# EAGLE design MOD (EAGLE 9.2.2)
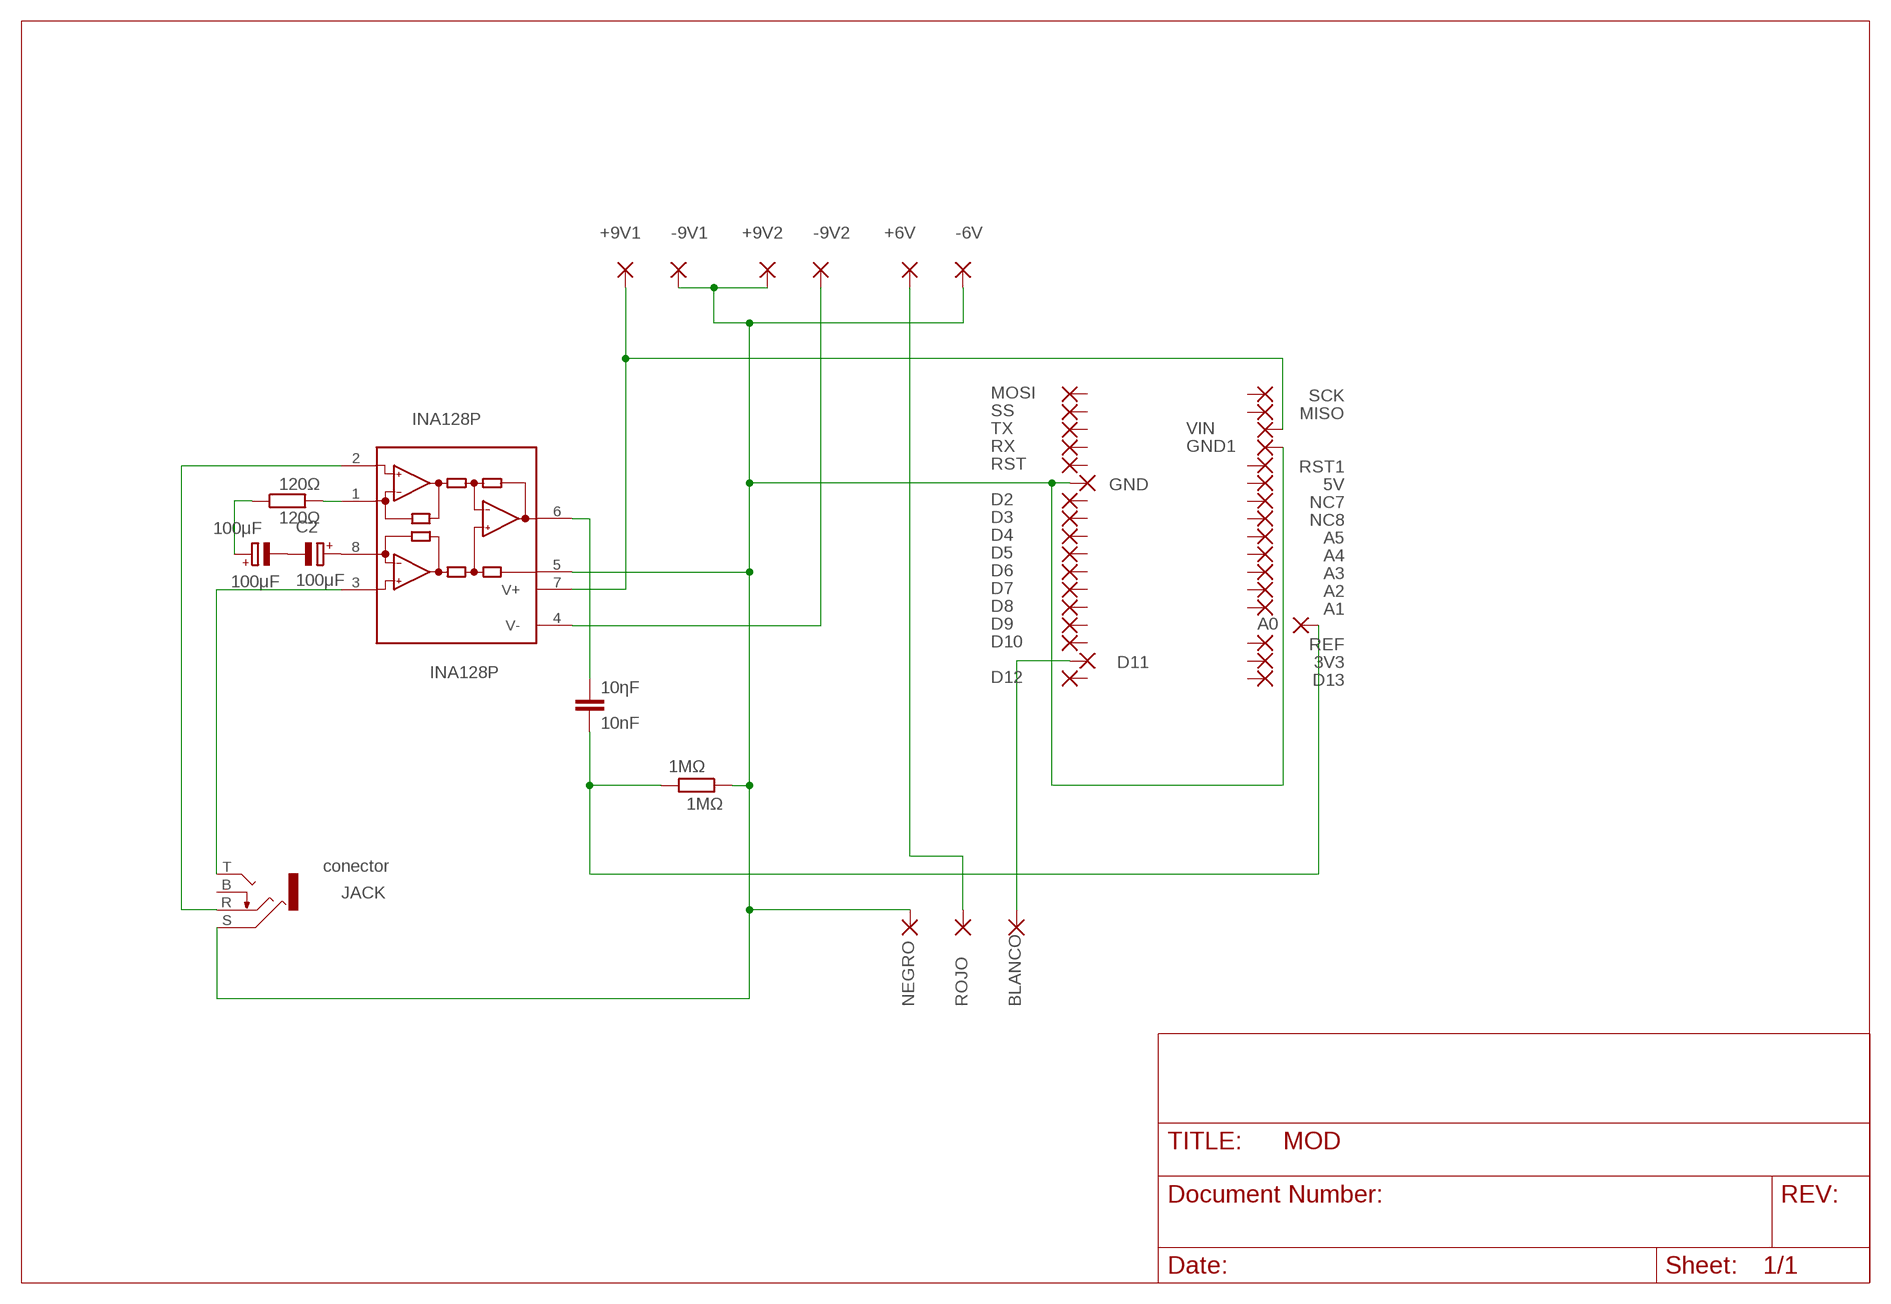
[diagram p0: schematic, sheet 1]

## Parts
1MΩ  1MΩ  R-EU_0207/15  [0207/15]
3V3  1,6/0,9  [1,6/0,9]
5V  1,6/0,9  [1,6/0,9]
10ηF  10nF  C-EU050-030X075  [C050-030X075]
100μF  100μF  CPOL-EUB45181B  [B45181B]
120Ω  120Ω  R-EU_0207/15  [0207/15]
+6V  2,54/1,1  [2,54/1,1]
+9V1  2,54/1,1  [2,54/1,1]
+9V2  2,54/1,1  [2,54/1,1]
-6V  2,54/1,1  [2,54/1,1]
-9V1  2,54/1,1  [2,54/1,1]
-9V2  2,54/1,1  [2,54/1,1]
A0  1,6/0,9  [1,6/0,9]
A1  1,6/0,9  [1,6/0,9]
A2  1,6/0,9  [1,6/0,9]
A3  1,6/0,9  [1,6/0,9]
A4  1,6/0,9  [1,6/0,9]
A5  1,6/0,9  [1,6/0,9]
BLANCO  1,6/0,9  [1,6/0,9]
C2  100μF  CPOL-EUB45181B  [B45181B]
D2  1,6/0,9  [1,6/0,9]
D3  1,6/0,9  [1,6/0,9]
D4  1,6/0,9  [1,6/0,9]
D5  1,6/0,9  [1,6/0,9]
D6  1,6/0,9  [1,6/0,9]
D7  1,6/0,9  [1,6/0,9]
D8  1,6/0,9  [1,6/0,9]
D9  1,6/0,9  [1,6/0,9]
D10  1,6/0,9  [1,6/0,9]
D11  1,6/0,9  [1,6/0,9]
D12  1,6/0,9  [1,6/0,9]
D13  1,6/0,9  [1,6/0,9]
GND  1,6/0,9  [1,6/0,9]
GND1  1,6/0,9  [1,6/0,9]
INA128P  INA128P  [DIL08]
JACK  conector  KLBR4  [KLBR4]
MISO  1,6/0,9  [1,6/0,9]
MOSI  1,6/0,9  [1,6/0,9]
NC7  1,6/0,9  [1,6/0,9]
NC8  1,6/0,9  [1,6/0,9]
NEGRO  1,6/0,9  [1,6/0,9]
REF  1,6/0,9  [1,6/0,9]
ROJO  1,6/0,9  [1,6/0,9]
RST  1,6/0,9  [1,6/0,9]
RST1  1,6/0,9  [1,6/0,9]
RX  1,6/0,9  [1,6/0,9]
SCK  1,6/0,9  [1,6/0,9]
SS  1,6/0,9  [1,6/0,9]
TX  1,6/0,9  [1,6/0,9]
VIN  1,6/0,9  [1,6/0,9]

## Nets
+6VCC: +6V.1(P) ROJO.1(P)
+9VCC: +9V1.1(P) INA128P.7(V+) VIN.1(P)
-9VCC: -9V2.1(P) INA128P.4(V-)
A0: 1MΩ.2 10ηF.2 A0.1(P)
CONTROL_SERVO: BLANCO.1(P) D11.1(P)
E1: INA128P.2(-IN) JACK.R
E2: INA128P.3(+IN) JACK.T
GND: 1MΩ.1 +9V2.1(P) -6V.1(P) -9V1.1(P) GND1.1(P) GND.1(P) INA128P.5(REF) JACK.S NEGRO.1(P)
N$1: C2.+ INA128P.8(RG)
N$2: 100μF.- C2.-
N$3: 120Ω.2 INA128P.1(RG)
N$4: 100μF.+ 120Ω.1
N$5: 10ηF.1 INA128P.6(OUT)
Unconnected: 3V3.1(P) 5V.1(P) A1.1(P) A2.1(P) A3.1(P) A4.1(P) A5.1(P) D2.1(P) D3.1(P) D4.1(P) D5.1(P) D6.1(P) D7.1(P) D8.1(P) D9.1(P) D10.1(P) D12.1(P) D13.1(P) JACK.B MISO.1(P) MOSI.1(P) NC7.1(P) NC8.1(P) REF.1(P) RST1.1(P) RST.1(P) RX.1(P) SCK.1(P) SS.1(P) TX.1(P)

## Library data of the parts
1MΩ 120Ω = rcl:R-EU_: RESISTOR, European symbol; SPICEPREFIX: R
3V3 5V A0 A1-A5 BLANCO D2-D13 GND GND1 MISO MOSI NC7 NC8 NEGRO REF ROJO RST RST1 RX SCK SS TX VIN = wirepad:1,6/0,9: THROUGH-HOLE PAD
10ηF = rcl:C-EU: CAPACITOR, European symbol; SPICEPREFIX: C
100μF C2 = rcl:CPOL-EU: POLARIZED CAPACITOR, European symbol; SPICEPREFIX: C
+6V +9V1 +9V2 -6V -9V1 -9V2 = wirepad:2,54/1,1: THROUGH-HOLE PAD
INA128P = burr-brown:INA128: Instrumentation Amplifiers Precision, Low Power; MF: TEXAS INSTRUMENTS; MPN: INA128P; OC_FARNELL: 1212410; OC_NEWARK: 74C9783
JACK = con-lumberg:KLBR4: Jack connectors according to JISC 6560, 3.5 mm Klinkeneinbaukupplung nach JISC 6560, 3,5 mm, 3-polig/ stereo, abgewinkelte Ausführung, mit Öffner, für Leiterplatten Source: Data sheet <http://www.lumberg.com/Produkte/PDFs/KLBR4.pdf>; MPN: KLBR 4; OC_FARNELL: 1217016; OC_NEWARK: 97K2709

## Board
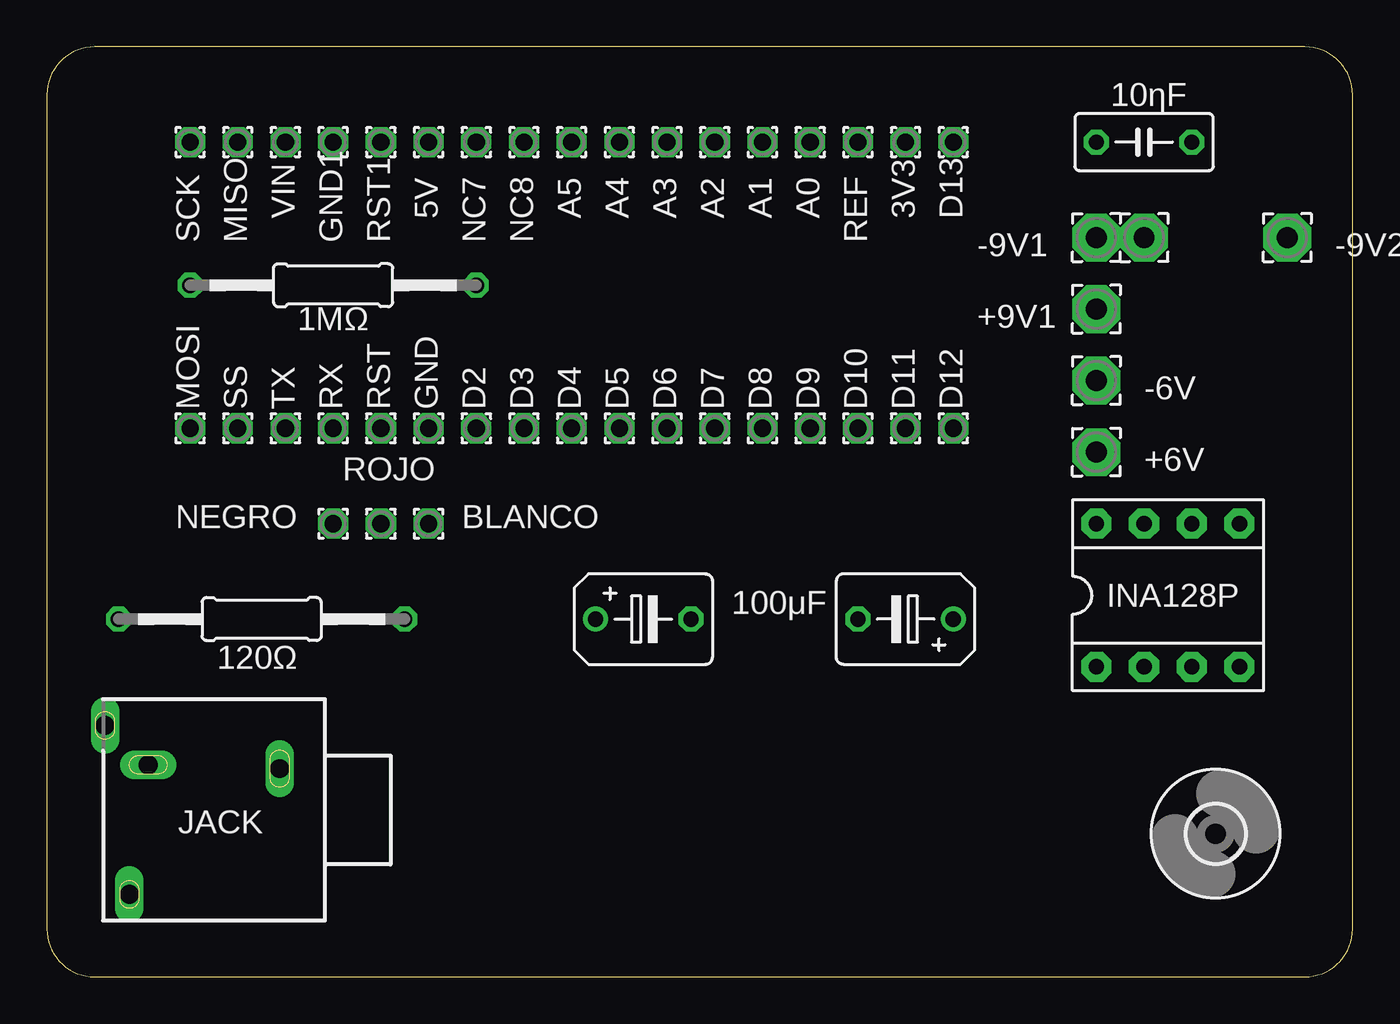
[diagram p1: board, top side]
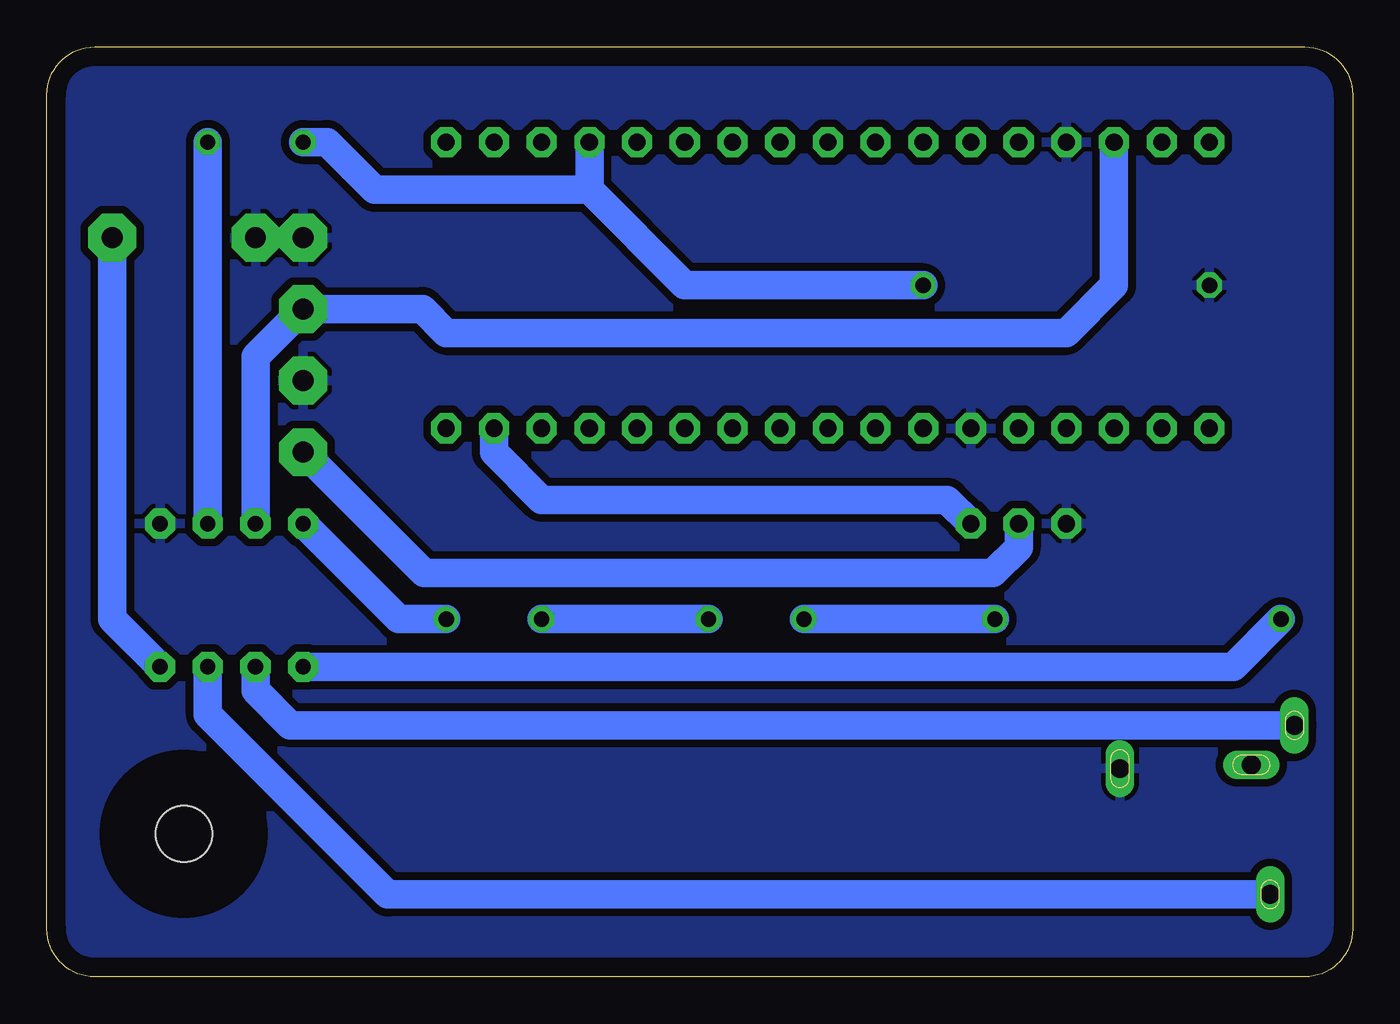
[diagram p2: board, bottom side, seen from below]

Size 69.52 x 49.52 mm. Coordinates in mm from the lower left corner, seen from the top.
Outline: 0,46.98 0,2.54 arc90 2.54,0 66.98,0 arc90 69.52,2.54 69.52,46.98 arc90 66.98,49.52 2.54,49.52 arc90 0,46.98
Copper layers (1*16): Top 0.035mm / dielectric 1.5mm / Bottom 0.035mm
Design rules "default": minimum track width 6mil, minimum drill 0.35mm, track to track 6mil, track to pad 6mil, pad to pad 6mil, via to via 6mil, smd to smd 6mil, copper to edge 40mil, drill to drill 6mil, minimum pad ring 10mil, minimum via ring 8mil, stop-mask expansion 4mil, vias tented up to drill 0mil, thermal gap 10mil

### Footprints (pad centres in the part's own frame; a part is rotated, then mirrored left to right if it is on the bottom)
0207/15 = drill 0.813 octagon: 1 -7.62,0; 2 7.62,0
1,6/0,9 = drill 0.914 pad 1.6 octagon: 1 0,0
C050-030X075 = drill 0.813 octagon: 1 -2.54,0; 2 2.54,0
B45181B = drill 0.813: + -2.54,0 | drill 0.813 octagon: - 2.54,0
2,54/1,1 = drill 1.118 pad 2.54 octagon: 1 0,0
DIL08 = drill 0.813 pad 1.6 octagon: 1 -3.81,-3.81; 2 -1.27,-3.81; 3 1.27,-3.81; 4 3.81,-3.81; 5 3.81,3.81; 6 1.27,3.81; 7 -1.27,3.81; 8 -3.81,3.81
KLBR4 = drill 1 pad 1.3 long: B -2.4,-3.5; S -2.2,3.5 | drill 1 pad 1.2 long: R -4.5,-5.8; T 4.5,-4.5
3,0 = hole 3: 0,0

### Placement (x,y rotation side)
1MΩ  15.24,36.83 0 top
3V3  45.72,44.45 0 top
5V  20.32,44.45 0 top
10ηF  58.42,44.45 180 top
100μF  31.75,19.05 0 top
120Ω  11.43,19.05 180 top
+6V  55.88,27.94 0 top
+9V1  55.88,35.56 0 top
+9V2  58.42,39.37 0 top
-6V  55.88,31.75 0 top
-9V1  55.88,39.37 0 top
-9V2  66.04,39.37 0 top
A0  40.64,44.45 0 top
A1  38.1,44.45 0 top
A2  35.56,44.45 0 top
A3  33.02,44.45 0 top
A4  30.48,44.45 0 top
A5  27.94,44.45 0 top
BLANCO  20.32,24.13 0 top
C2  45.72,19.05 180 top
D2  22.86,29.21 0 top
D3  25.4,29.21 0 top
D4  27.94,29.21 0 top
D5  30.48,29.21 0 top
D6  33.02,29.21 0 top
D7  35.56,29.21 0 top
D8  38.1,29.21 0 top
D9  40.64,29.21 0 top
D10  43.18,29.21 0 top
D11  45.72,29.21 0 top
D12  48.26,29.21 0 top
D13  48.26,44.45 0 top
GND  20.32,29.21 0 top
GND1  15.24,44.45 0 top
INA128P  59.69,20.32 0 top
JACK  8.89,8.89 270 top
MISO  10.16,44.45 0 top
MOSI  7.62,29.21 0 top
NC7  22.86,44.45 0 top
NC8  25.4,44.45 0 top
NEGRO  15.24,24.13 0 top
REF  43.18,44.45 0 top
ROJO  17.78,24.13 0 top
RST  17.78,29.21 0 top
RST1  17.78,44.45 0 top
RX  15.24,29.21 0 top
SCK  7.62,44.45 0 top
SS  10.16,29.21 0 top
TX  12.7,29.21 0 top
U$2  [3,0]  62.23,7.62 0 top
VIN  12.7,44.45 0 top

### Tracks (layer width: path | path; a pad name or v marks a point on that pad's centre or on a via)
+6VCC
  Bottom 1.524: ROJO.1 17.78,22.86 19.14,21.5 49.44,21.5 +6V.1
+9VCC
  Bottom 1.524: INA128P.7 58.42,33.02 +9V1.1 49.53,35.56 48.26,34.29 15.24,34.29 12.7,36.83 VIN.1
-9VCC
  Bottom 1.524: INA128P.4 66.04,19.05 -9V2.1
A0
  Bottom 1.524: 40.64,41.91 A0.1 | 10ηF.2 54.61,44.45 52.07,41.91 40.64,41.91 | 40.64,41.91 35.56,36.83 1MΩ.2
CONTROL_SERVO
  Bottom 1.524: BLANCO.1 21.59,25.4 43.18,25.4 45.72,27.94 D11.1
E1
  Bottom 1.524: JACK.R 56.57,13.39 58.42,15.24 INA128P.2
E2
  Bottom 1.524: JACK.T 51.38,4.39 60.96,13.97 INA128P.3
GND
  pour Bottom (isolate 0.406): 0,49.53 69.85,49.53 69.85,0 0,0
N$1
  Bottom 1.524: C2.+ 50.8,19.05 INA128P.8
N$2
  Bottom 1.524: C2.- 100μF.-
N$3
  Bottom 1.524: 120Ω.2 6.35,16.51 INA128P.1
N$4
  Bottom 1.524: 100μF.+ 120Ω.1
N$5
  Bottom 1.524: 10ηF.1 INA128P.6